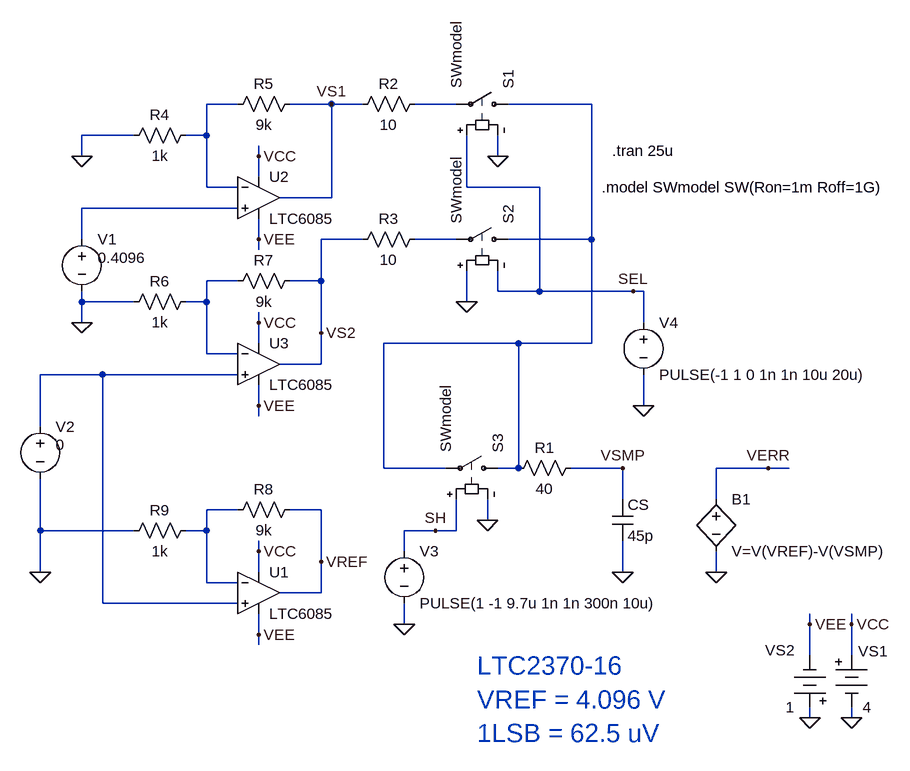
[diagram p0: schematic fig-02-06-04.asc]
fig-02-06-04.asc, the LTspice schematic file:
Version 4
SHEET 1 1396 680
WIRE 176 -496 128 -496
WIRE 320 -496 256 -496
WIRE 368 -496 320 -496
WIRE 512 -496 448 -496
WIRE 720 -496 592 -496
WIRE 16 -448 -64 -448
WIRE 128 -448 128 -496
WIRE 128 -448 96 -448
WIRE -64 -416 -64 -448
WIRE 208 -416 208 -432
WIRE 576 -416 576 -448
WIRE 208 -384 208 -416
WIRE 128 -368 128 -448
WIRE 176 -368 128 -368
WIRE 528 -368 528 -448
WIRE 640 -368 528 -368
WIRE 320 -352 320 -496
WIRE 320 -352 240 -352
WIRE 176 -336 -64 -336
WIRE -64 -288 -64 -336
WIRE 208 -288 208 -320
WIRE 368 -288 304 -288
WIRE 512 -288 448 -288
WIRE 720 -288 720 -496
WIRE 720 -288 592 -288
WIRE 208 -272 208 -288
WIRE 176 -224 128 -224
WIRE 304 -224 304 -288
WIRE 304 -224 256 -224
WIRE 576 -208 576 -240
WIRE 640 -208 640 -368
WIRE 640 -208 576 -208
WIRE 784 -208 640 -208
WIRE 800 -208 784 -208
WIRE -64 -192 -64 -208
WIRE 16 -192 -64 -192
WIRE 128 -192 128 -224
WIRE 128 -192 96 -192
WIRE 528 -192 528 -240
WIRE -64 -160 -64 -192
WIRE 208 -160 208 -176
WIRE 800 -160 800 -208
WIRE 304 -144 304 -224
WIRE 208 -128 208 -160
WIRE 608 -128 400 -128
WIRE 720 -128 720 -288
WIRE 720 -128 608 -128
WIRE 128 -112 128 -192
WIRE 176 -112 128 -112
WIRE 304 -96 304 -144
WIRE 304 -96 240 -96
WIRE -32 -80 -128 -80
WIRE 176 -80 -32 -80
WIRE 208 -32 208 -64
WIRE 800 -32 800 -80
WIRE 208 -16 208 -32
WIRE -128 0 -128 -80
WIRE 400 64 400 -128
WIRE 496 64 400 64
WIRE 608 64 608 -128
WIRE 608 64 576 64
WIRE 768 64 688 64
WIRE 992 64 912 64
WIRE 1024 64 992 64
WIRE 768 112 768 64
WIRE 912 112 912 64
WIRE 176 128 128 128
WIRE 304 128 256 128
WIRE 560 144 560 112
WIRE -128 160 -128 80
WIRE 16 160 -128 160
WIRE 128 160 128 128
WIRE 128 160 96 160
WIRE 480 160 432 160
WIRE 512 160 512 112
WIRE 512 160 480 160
WIRE 208 192 208 176
WIRE 432 192 432 160
WIRE 304 208 304 128
WIRE -128 224 -128 160
WIRE 208 224 208 192
WIRE 768 224 768 176
WIRE 912 224 912 192
WIRE 128 240 128 160
WIRE 176 240 128 240
WIRE 304 256 304 208
WIRE 304 256 240 256
WIRE -32 272 -32 -80
WIRE 176 272 -32 272
WIRE 432 304 432 272
WIRE 1056 304 1056 288
WIRE 1120 304 1120 288
WIRE 208 320 208 288
WIRE 208 336 208 320
WIRE 1056 352 1056 304
WIRE 1120 352 1120 304
WIRE 1056 448 1056 432
WIRE 1120 448 1120 432
FLAG -64 -160 0
FLAG 768 224 0
FLAG 768 64 VSMP
FLAG 432 304 0
FLAG 480 160 SH
FLAG 1056 448 0
FLAG 1120 448 0
FLAG 1056 304 VEE
FLAG 1120 304 VCC
FLAG 800 -32 0
FLAG -128 224 0
FLAG 208 -416 VCC
FLAG 208 -160 VCC
FLAG 208 -288 VEE
FLAG 208 -32 VEE
FLAG -64 -416 0
FLAG 320 -496 VS1
FLAG 304 -144 VS2
FLAG 912 224 0
FLAG 992 64 VERR
FLAG 576 -416 0
FLAG 528 -192 0
FLAG 208 192 VCC
FLAG 208 320 VEE
FLAG 304 208 VREF
FLAG 560 144 0
FLAG 784 -208 SEL
SYMBOL voltage -64 -304 R0
WINDOW 123 0 0 Left 0
WINDOW 39 0 0 Left 0
WINDOW 3 24 44 Left 2
SYMATTR Value 0.4096
SYMATTR InstName V1
SYMBOL voltage 432 176 R0
WINDOW 123 0 0 Left 0
WINDOW 39 0 0 Left 0
SYMATTR InstName V3
SYMATTR Value PULSE(1 -1 9.7u 1n 1n 300n 10u)
SYMBOL cap 752 112 R0
SYMATTR InstName CS
SYMATTR Value 45p
SYMBOL res 704 48 R90
WINDOW 0 0 56 VBottom 2
WINDOW 3 32 56 VTop 2
SYMATTR InstName R1
SYMATTR Value 40
SYMBOL Misc\\battery 1120 336 R0
WINDOW 0 10 10 Left 2
WINDOW 3 17 96 Left 2
WINDOW 123 0 0 Left 0
WINDOW 39 0 0 Left 0
SYMATTR InstName VS1
SYMATTR Value 4
SYMBOL Misc\\battery 1056 448 R180
WINDOW 0 24 104 Left 2
WINDOW 3 24 16 Left 2
WINDOW 123 0 0 Left 0
WINDOW 39 0 0 Left 0
SYMATTR InstName VS2
SYMATTR Value 1
SYMBOL voltage 800 -176 R0
WINDOW 123 0 0 Left 0
WINDOW 39 0 0 Left 0
SYMATTR InstName V4
SYMATTR Value PULSE(-1 1 0 1n 1n 10u 20u)
SYMBOL voltage -128 -16 R0
WINDOW 123 0 0 Left 0
WINDOW 39 0 0 Left 0
WINDOW 3 24 44 Left 2
SYMATTR Value 0
SYMATTR InstName V2
SYMBOL res 464 -512 R90
WINDOW 0 0 56 VBottom 2
WINDOW 3 32 56 VTop 2
SYMATTR InstName R2
SYMATTR Value 10
SYMBOL res 464 -304 R90
WINDOW 0 0 56 VBottom 2
WINDOW 3 32 56 VTop 2
SYMATTR InstName R3
SYMATTR Value 10
SYMBOL Opamps\\LTC6085 208 -352 R0
SYMATTR InstName U2
SYMBOL Opamps\\LTC6085 208 -96 R0
SYMATTR InstName U3
SYMBOL res 272 -512 R90
WINDOW 0 0 56 VBottom 2
WINDOW 3 32 56 VTop 2
SYMATTR InstName R5
SYMATTR Value 9k
SYMBOL res 272 -240 R90
WINDOW 0 0 56 VBottom 2
WINDOW 3 32 56 VTop 2
SYMATTR InstName R7
SYMATTR Value 9k
SYMBOL res 112 -464 R90
WINDOW 0 0 56 VBottom 2
WINDOW 3 32 56 VTop 2
SYMATTR InstName R4
SYMATTR Value 1k
SYMBOL res 112 -208 R90
WINDOW 0 0 56 VBottom 2
WINDOW 3 32 56 VTop 2
SYMATTR InstName R6
SYMATTR Value 1k
SYMBOL bv 912 96 R0
SYMATTR InstName B1
SYMATTR Value V=V(VREF)-V(VSMP)
SYMBOL sw 608 -496 M270
SYMATTR InstName S1
SYMATTR Value SWmodel
SYMBOL sw 608 -288 M270
SYMATTR InstName S2
SYMATTR Value SWmodel
SYMBOL Opamps\\LTC6085 208 256 R0
SYMATTR InstName U1
SYMBOL res 272 112 R90
WINDOW 0 0 56 VBottom 2
WINDOW 3 32 56 VTop 2
SYMATTR InstName R8
SYMATTR Value 9k
SYMBOL res 112 144 R90
WINDOW 0 0 56 VBottom 2
WINDOW 3 32 56 VTop 2
SYMATTR InstName R9
SYMATTR Value 1k
SYMBOL sw 592 64 M270
SYMATTR InstName S3
SYMATTR Value SWmodel
TEXT 752 -424 Left 2 !.tran 25u
TEXT 544 368 Left 4 ;LTC2370-16\nVREF = 4.096 V\n1LSB = 62.5 uV
TEXT 736 -368 Left 2 !.model SWmodel SW(Ron=1m Roff=1G)

The netlist it stands for:
* fig-02-06-04.asc
V1 N004 0 0.4096
V3 SH 0 PULSE(1 -1 9.7u 1n 1n 300n 10u)
CS VSMP 0 45p
R1 VSMP N003 40
VS1 VCC 0 4
VS2 0 VEE 1
V4 SEL 0 PULSE(-1 1 0 1n 1n 10u 20u)
V2 N007 0 0
R2 N002 VS1 10
R3 N005 VS2 10
* U2: LTC6085 (symbol Opamps\LTC6085 not available, pins judged from their places): In+=N004 In-=N001 V+=VCC V-=VEE OUT=VS1
* U3: LTC6085 (symbol Opamps\LTC6085 not available, pins judged from their places): In+=N007 In-=N006 V+=VCC V-=VEE OUT=VS2
R5 VS1 N001 9k
R7 VS2 N006 9k
R4 N001 0 1k
R6 N006 0 1k
B1 VERR 0 V=V(VREF)-V(VSMP)
S1 N003 N002 SEL 0 SWmodel
S2 N003 N005 0 SEL SWmodel
* U1: LTC6085 (symbol Opamps\LTC6085 not available, pins judged from their places): In+=N007 In-=N008 V+=VCC V-=VEE OUT=VREF
R8 VREF N008 9k
R9 N008 0 1k
S3 N003 N003 SH 0 SWmodel
.tran 25u
* LTC2370-16
* VREF = 4.096 V
* 1LSB = 62.5 uV
.model SWmodel SW(Ron=1m Roff=1G)
.backanno
.end